# Altium schematic sheet Power.SchDoc
size A4
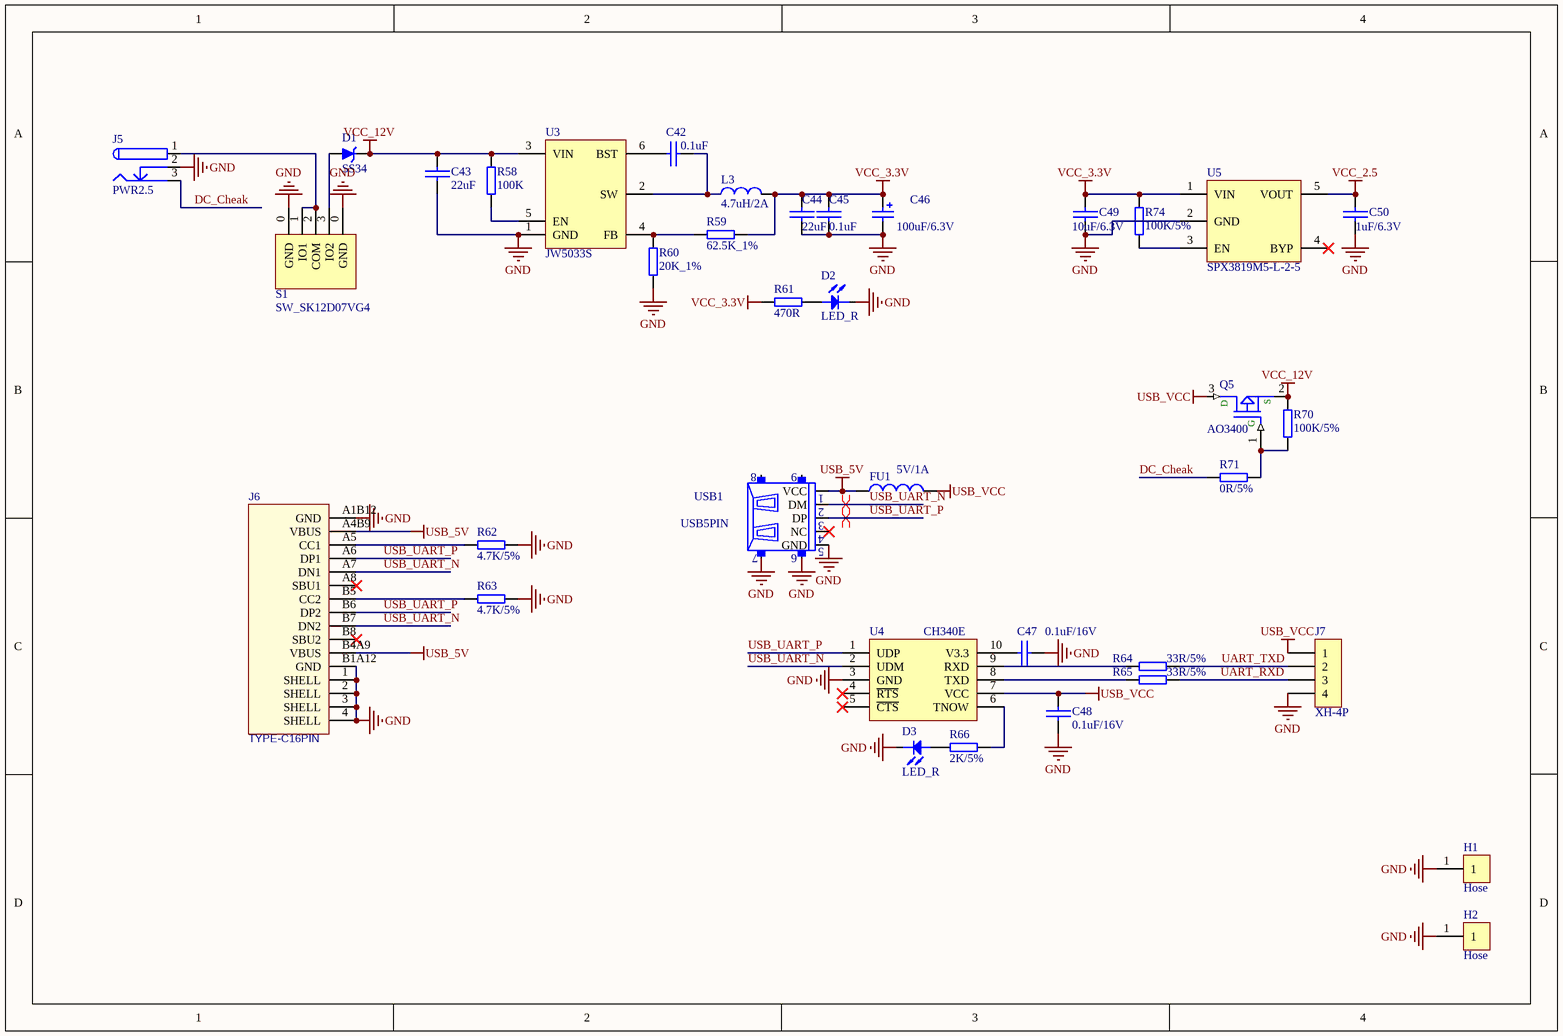
[diagram p0: Power.SchDoc]

## Parts
C42  0.1uF  [0402C]
C43  22uF  [0805C]
C44  22uF  [0805C]
C45  0.1uF  [0402C]
C46  100uF/6.3V  [3528C]
C47  0.1uF/16V  [0402C]
C48  0.1uF/16V  [0402C]
C49  10uF/6.3V  [0402C]
C50  1uF/6.3V  [0402C]
D1  SS34  [SMB]
D2  LED_R  [LED-0603]
D3  LED_R  [LED-0603]
FU1  5V/1A  [0603]
H1  Hose  [HOSE]
H2  Hose  [HOSE]
J5  PWR2.5  [pw2.5]
J6  TYPE-C16PIN  [USB-C-SMD_TYPE-C16PIN]
J7  XH-4P  [DG1284]
L3  4.7uH/2A  [CD54]
Q5  AO3400  [SOT23]
R58  100K  [0402R]
R59  62.5K_1%  [0402R]
R60  20K_1%  [0402R]
R61  470R  [0402R]
R62  4.7K/5%  [0402R]
R63  4.7K/5%  [0402R]
R64  33R/5%  [0402R]
R65  33R/5%  [0402R]
R66  2K/5%  [0402R]
R70  100K/5%  [0402R]
R71  0R/5%  [0402R]
R74  100K/5%  [0402R]
S1  SW_SK12D07VG4  [SW_SK12D07VG3]
U3  JW5033S  [SOT-23-6]
U4  CH340E  [MSOP10]
U5  SPX3819M5-L-2-5  [SOT-23-5]
USB1  USB5PIN  [MICROUSB]

## Nets
GND: C43.2 C44.2 C45.1 C46.2 C47.2 C48.1 C49.2 C50.2 D2.2 D3.2 H1.1 H2.1 J5.2 J6.1(SHELL) J6.2(SHELL) J6.3(SHELL) J6.4(SHELL) J6.A1B12(GND) J6.B1A12(GND) J7.4 R60.1 R62.1 R63.1 S1.0(GND) U3.1(GND) U4.3(GND) U5.2(GND) USB1.5(GND) USB1.6 USB1.7
USB_5V: FU1.1 J6.A4B9(VBUS) J6.B4A9(VBUS) USB1.1(VCC)
USB_VCC: C48.2 FU1.2 J7.1 Q5.3 U4.7(VCC)
VCC_2.5: C50.1 U5.5(VOUT)
VCC_3.3V: C44.1 C45.2 C46.1 C49.1 L3.1 R59.1 R61.1 R74.1 U5.1(VIN)
VCC_12V: C43.1 D1.2 Q5.2 R58.1 R70.2 U3.3(VIN)
DC_Cheak: J5.3 R71.2
UART_RXD: J7.3 R65.1
UART_TXD: J7.2 R64.1
USB_UART_N: J6.A7(DN1) J6.B7(DN2) U4.2(UDM) USB1.2(DM)
USB_UART_P: J6.A6(DP1) J6.B6(DP2) U4.1(UDP) USB1.3(DP)
NetC42_1: C42.1 U3.6(BST)
NetC42_2: C42.2 L3.2 U3.2(SW)
NetC47_1: C47.1 U4.10(V3.3)
NetD1_1: D1.1 S1.3(IO2)
NetD2_1: D2.1 R61.2
NetD3_1: D3.1 R66.1
NetJ5_1: J5.1 S1.1(IO1) S1.2(COM)
NetJ6_A5: J6.A5(CC1) R62.2
NetJ6_B5: J6.B5(CC2) R63.2
NetQ5_1: Q5.1 R70.1 R71.1
NetR58_2: R58.2 U3.5(EN)
NetR59_2: R59.2 R60.2 U3.4(FB)
NetR64_2: R64.2 U4.9(RXD)
NetR65_2: R65.2 U4.8(TXD)
NetR66_2: R66.2 U4.6(TNOW)
NetR74_2: R74.2 U5.3(EN)

Not connected (* = marked no-connect by the designer): J6 A8(SBU1)* B8(SBU2)*; U4 4(~{RTS})* 5(~{CTS})*; U5 4(BYP)*; USB1 4(NC)* 8 9

## Layout directives
differential pair: USB_UART_N, USB_UART_P

## Notes on the sheet
- (in symbol MOS-P) S; D; G

## Library data of the parts
C42-C45 C47-C50 = CAP: Capacitor
C46 = Cap Pol2: 插件电解电容; Published: 8-Jun-2000; LatestRevisionDate: 17-Jul-2002; LatestRevisionNote: Re-released for DXP Platform.; PackageReference: POLAR0.8; Publisher: Altium Limited; Value: 100uF/6.3V
D1 = DIODE_VZ
D2 D3 = LED
FU1 = FB-90R-100Mhz
J5 = PWR2.5: Low Voltage Power Supply Connector; Published: 17-Dec-2003; DatasheetDocument: 09-May-2002; Publisher: Altium Limited; ComponentLink1Description: Manufacturer Link; ComponentLink1URL: http://domino.kycon.com/internet/Products.html
J6 = TYPE-C16PIN: BOM_Manufacturer: SHOU HAN; Contributor: LCSC; BOM_Supplier: LCSC; BOM_Supplier Part: C393939; BOM_Manufacturer Part: TYPE-C16PIN; spicePre: U; spiceSymbolName: TYPE-C16PIN
J7 = CON4
L3 = L-4.7uH-1206
Q5 = MOS-P
R58-R66 R70 R71 R74 = RES1
U5 = SPX3819M5
USB1 = USB-5PIN